# EAGLE design Slave (EAGLE 9.1.3)
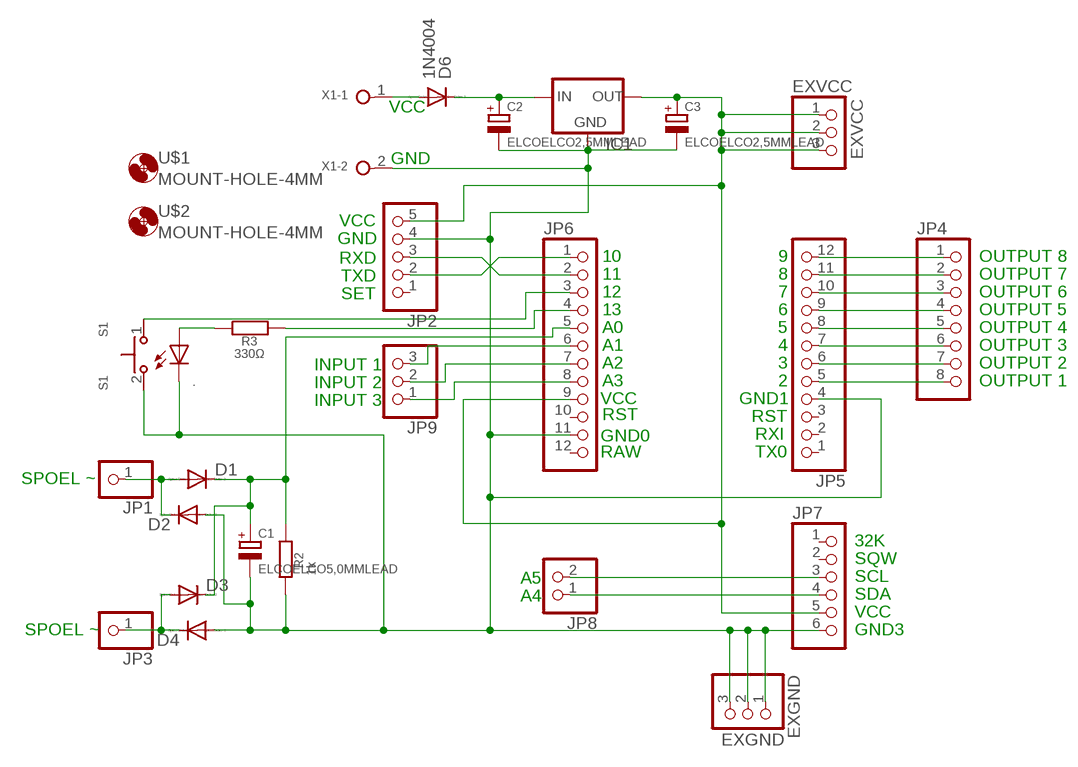
[diagram p0: schematic, sheet 1]

## Parts
.  LED  LED-SMD1206  [CHIPLED_1206]
C1  ELCOELCO5,0MMLEAD  [ELCO5,0MMLEAD]
C2  ELCOELCO2,5MMLEAD  [ELCO-2.5MMLEAD]
C3  ELCOELCO2,5MMLEAD  [ELCO-2.5MMLEAD]
D1  1N4004  [DO41-10]
D2  1N4004  [DO41-10]
D3  1N4004  [DO41-10]
D4  1N4004  [DO41-10]
D6  1N4004  [DO41-10]
EXGND  PINHD-1X3  [1X03]
EXVCC  PINHD-1X3  [1X03]
IC1  78XXS  [78XXS]
JP1  PINHD-1X1  [1X01]
JP2  PINHD-1X5  [1X05]
JP3  PINHD-1X1  [1X01]
JP4  PINHD-1X8  [1X08]
JP5  PINHD-1X12  [1X12]
JP6  PINHD-1X12  [1X12]
JP7  PINHD-1X6  [1X06]
JP8  PINHD-1X2  [1X02]
JP9  PINHD-1X3  [1X03]
R2  1k  RESISTOR-SMD-1206  [R1206W]
R3  330Ω  RESISTOR-SMD-1206  [R1206W]
S1  MICROSWITCH-B3U-1000P  [MICROSWITCH-B3U-1000P]
U$1  MOUNT-HOLE-4MM  [4,0]
U$2  MOUNT-HOLE-4MM  [4,0]
X1  TERMINAL-5MM-2POLE  [W237-132]

## Nets
GND [VCC]: ..C C1.- C2.- C3.- D2.A D4.A EXGND.1 EXGND.2 EXGND.3 IC1.GND JP2.4 JP5.4 JP6.11 JP7.6 R2.1 S1.2 X1.2
N$1: JP7.4 JP8.1
N$2: JP7.3 JP8.2
N$3: JP4.1 JP5.12
N$4: JP4.2 JP5.11
N$5: JP4.3 JP5.10
N$6: JP4.4 JP5.9
N$7: JP4.5 JP5.8
N$8: JP4.6 JP5.7
N$9: JP4.7 JP5.6
N$10: JP4.8 JP5.5
N$12: D1.A D2.C JP1.1
N$13: C1.+ D1.C D3.C JP6.5 R2.2
N$14: JP6.8 JP9.1
N$15: D3.A D4.C JP3.1
N$16: JP6.7 JP9.2
N$17: JP6.6 JP9.3
N$19: JP2.2 JP6.1
N$20: JP6.4 R3.2
N$21: JP2.3 JP6.2
N$22: ..A R3.1
N$23: JP6.3 S1.1
VCC0 [VCC]: D6.A X1.1
VCC1 [VCC]: C2.+ D6.C IC1.IN
VCC2 [VCC]: C3.+ EXVCC.1 EXVCC.2 EXVCC.3 IC1.OUT JP2.5 JP6.9 JP7.5
Unconnected: JP2.1 JP5.1 JP5.2 JP5.3 JP6.10 JP6.12 JP7.1 JP7.2

## Notes on the sheet
- VCC
- GND
- VCC
- GND
- RXD | 10 | 9 | OUTPUT 8
- TXD | 11 | 8 | OUTPUT 7
- SET | 12 | 7 | OUTPUT 6
- 13 | 6 | OUTPUT 5
- A0 | 5 | OUTPUT 4
- A1 | 4 | OUTPUT 3
- INPUT 1 | A2 | 3 | OUTPUT 2
- INPUT 2 | A3 | 2 | OUTPUT 1
- INPUT 3 | VCC | GND1
- RST | RST
- GND0 | RXI
- RAW | TX0
- SPOEL ~
- 32K
- SQW
- A5 | SCL
- A4 | SDA
- VCC
- SPOEL ~ | GND3

## Library data of the parts
. = test:LED-SMD: LED SMD 1206
C1-C3 = ESP8266-12F controller PCB:ELCO: electrolytic capacitor 2.5mm or 3.5mm lead or SMD
D1-D4 D6 = diode:1N4004: DIODE general purpose rectifier, 1 A
EXGND EXVCC JP9 = pinhead:PINHD-1X3: PIN HEADER
IC1 = ESP8266-12F controller PCB:78XXS: VOLTAGE REGULATOR
JP1 JP3 = pinhead:PINHD-1X1: PIN HEADER
JP2 = pinhead:PINHD-1X5: PIN HEADER
JP4 = pinhead:PINHD-1X8: PIN HEADER
JP5 JP6 = pinhead:PINHD-1X12: PIN HEADER
JP7 = pinhead:PINHD-1X6: PIN HEADER
JP8 = pinhead:PINHD-1X2: PIN HEADER
R2 R3 = ESP8266-12F controller PCB:RESISTOR-SMD-1206: Resistor 1206 SMD
S1 = ESP8266-12F controller PCB:MICROSWITCH-B3U-1000P: microswitch
U$1 U$2 = ESP8266-12F controller PCB:MOUNT-HOLE-4MM
X1 = ESP8266-12F controller PCB:TERMINAL-5MM-2POLE: WAGO SCREW CLAMP; OC_FARNELL: unknown; OC_NEWARK: unknown

## Net classes
1 VCC: width 1.016 mm

## Board
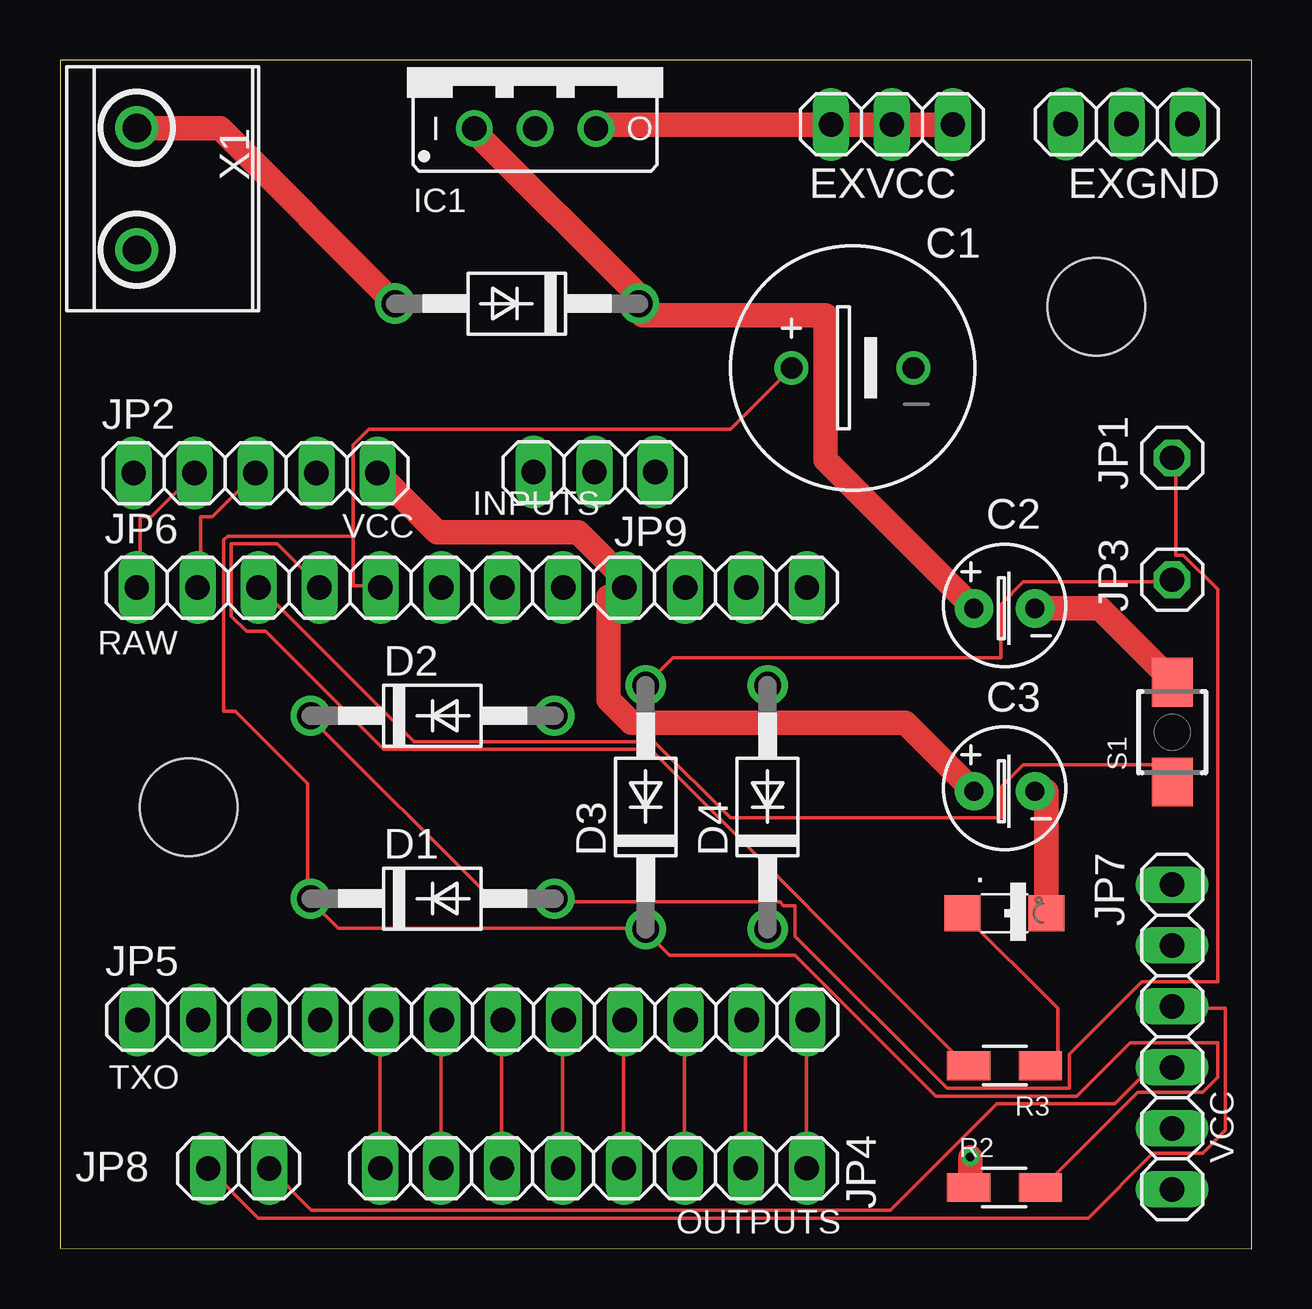
[diagram p1: board, top side]
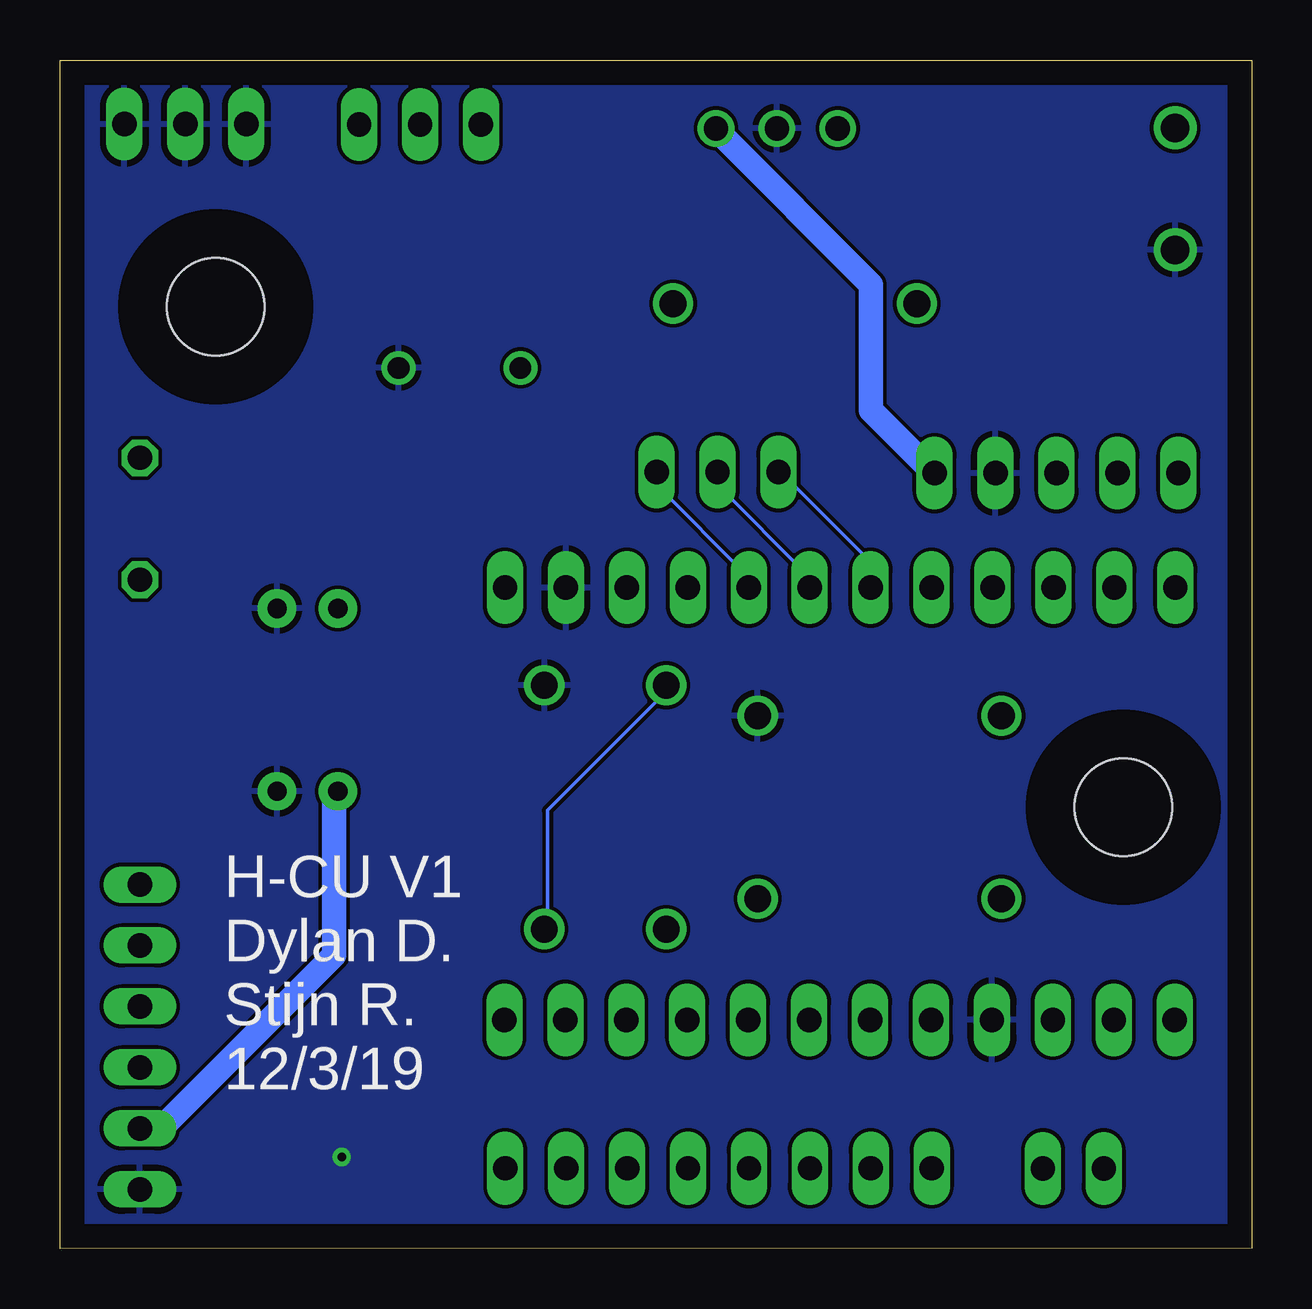
[diagram p2: board, bottom side, seen from below]

Size 49.69 x 49.54 mm. Coordinates in mm from the lower left corner, seen from the top.
Outline: 0,0.02 49.69,0 49.69,49.52 0,49.54 0,0.02
Copper layers (1*16): Top 0.035mm / dielectric 1.5mm / Bottom 0.035mm
Design rules "default": minimum track width 6mil, minimum drill 0.35mm, track to track 6mil, track to pad 6mil, pad to pad 6mil, via to via 6mil, smd to smd 6mil, copper to edge 40mil, drill to drill 6mil, minimum pad ring 10mil, minimum via ring 8mil, stop-mask expansion 4mil, vias tented up to drill 0mil, thermal gap 10mil

### Footprints (pad centres in the part's own frame; a part is rotated, then mirrored left to right if it is on the bottom)
CHIPLED_1206 = smd 1.5 x 1.5: A 0,-1.75; C 0,1.75
ELCO5,0MMLEAD = drill 0.9: + -2.54,0; - 2.54,0
ELCO-2.5MMLEAD = drill 0.8 pad 1.6: + -1.27,0; - 1.27,0
DO41-10 = drill 1.118: A 5.08,0; C -5.08,0
1X03 = drill 1.016 long: 1 -2.54,0; 2 0,0; 3 2.54,0
78XXS = drill 1.016: GND 0,-2.54; IN -2.54,-2.54; OUT 2.54,-2.54
1X01 = drill 1.016 octagon: 1 0,0
1X05 = drill 1.016 long: 1 -5.08,0; 2 -2.54,0; 3 0,0; 4 2.54,0; 5 5.08,0
1X08 = drill 1.016 long: 1 -8.89,0; 2 -6.35,0; 3 -3.81,0; 4 -1.27,0; 5 1.27,0; 6 3.81,0; 7 6.35,0; 8 8.89,0
1X12 = drill 1.016 long: 1 -13.97,0; 2 -11.43,0; 3 -8.89,0; 4 -6.35,0; 5 -3.81,0; 6 -1.27,0; 7 1.27,0; 8 3.81,0; 9 6.35,0; 10 8.89,0; 11 11.43,0; 12 13.97,0
1X06 = drill 1.016 long: 1 -6.35,0; 2 -3.81,0; 3 -1.27,0; 4 1.27,0; 5 3.81,0; 6 6.35,0
1X02 = drill 1.016 long: 1 -1.27,0; 2 1.27,0
R1206W = smd 1.8 x 1.2: 1 -1.499,0; 2 1.499,0
MICROSWITCH-B3U-1000P = smd 2.032 x 1.7: 1 -2.081,0; 2 2.081,0
4,0 = hole 4.064: 0,0
W237-132 = drill 1.194: 1 -2.54,-0.635; 2 2.54,-0.635

### Placement (x,y rotation side)
.  39.37,13.99 270 top
C1  33.03,36.71 0 top
C2  39.37,26.69 0 top
C3  39.37,19.07 0 top
D1  15.53,14.6 0 top
D2  15.53,22.22 0 top
D3  24.42,18.41 90 top
D4  29.5,18.41 90 top
D6  19.05,39.39 180 top
EXGND  44.46,46.87 180 top
EXVCC  34.68,46.86 0 top
IC1  19.8,49.23 0 top
JP1  46.36,32.96 90 top
JP2  8.15,32.33 0 top
JP3  46.36,27.88 90 top
JP4  22.24,3.36 180 top
JP5  17.19,9.54 0 top
JP6  17.17,27.55 0 top
JP7  46.36,8.83 270 top
JP8  7.45,3.36 180 top
JP9  22.28,32.37 180 top
R2  39.37,2.56 0 top
R3  39.37,7.64 180 top
S1  46.36,21.53 90 top
U$1  5.37,18.41 0 top
U$2  43.19,39.25 0 top
X1  3.84,44.17 270 top

### Tracks (layer width: path | path; a pad name or v marks a point on that pad's centre or on a via)
GND  (via drill 0.35)
  Top 1.016: C3.- 41.12,19.07 ..C | v37.94,3.83 37.94,2.56 R2.1 | C2.- 43.34,26.69 46.35,23.67 S1.2
  pour Bottom: 0,0.02 0,49.52 49.53,49.52 49.53,0.02
N$1
  Top 0.152: JP8.1 10.48,1.61 34.61,1.61 39.05,6.05 43.97,6.05 45.4,7.48 46.35,7.48 JP7.4
N$2
  Top 0.152: JP8.2 8.26,1.29 42.86,1.29 45.56,3.99 47.62,3.99 48.58,4.94 48.58,10.02 46.51,10.02 JP7.3
N$3
  Top 0.152: JP4.1 31.11,3.51 31.11,9.39 JP5.12
N$4
  Top 0.152: JP4.2 28.57,3.51 28.57,9.39 JP5.11
N$5
  Top 0.152: JP4.3 26.04,3.51 26.04,9.39 JP5.10
N$6
  Top 0.152: JP4.4 23.5,3.51 23.5,9.39 JP5.9
N$7
  Top 0.152: JP4.5 20.95,3.51 20.95,9.39 JP5.8
N$8
  Top 0.152: JP4.6 18.41,3.51 18.41,9.39 JP5.7
N$9
  Top 0.152: JP4.7 15.88,3.51 15.88,9.39 JP5.6
N$10
  Top 0.152: JP4.8 13.34,3.51 13.34,9.39 JP5.5
N$12
  Top 0.152: JP1.1 46.51,32.88 46.51,28.91 46.83,28.91 48.26,27.48 48.26,11.13 45.09,11.13 42.07,8.12 42.07,6.69 36.99,6.69 30.64,13.04 30.64,14.31 30.16,14.31 30,14.47 20.64,14.47 D1.A 20.48,14.62 17.94,14.62 10.48,22.09 D2.C
N$13
  Top 0.152: 12.22,29.71 12.22,27.64 13.34,27.64 JP6.5 | 12.22,29.71 12.22,33.52 12.86,34.15 27.94,34.15 30.48,36.69 C1.+ | R2.2 40.96,2.56 44.93,6.53 47.62,6.53 48.26,7.16 48.26,8.59 44.61,8.59 42.39,6.37 36.51,6.37 30.64,12.24 25.4,12.24 24.45,13.2 D3.C 24.29,13.35 11.59,13.35 10.48,14.47 D1.C 10.32,14.62 10.32,19.39 7.3,22.4 6.83,22.4 6.83,29.55 6.99,29.71 12.22,29.71
N$14
  Bottom 0.152: JP6.8 21.11,27.64 21.11,28.12 24.77,31.77 24.77,32.25 JP9.1
N$15
  Top 0.152: JP3.1 46.35,27.8 40.16,27.8 39.21,26.85 39.21,24.63 25.56,24.63 24.45,23.51 D3.A
  Bottom 0.152: D4.C 29.37,13.35 29.37,18.28 24.29,23.36 D3.A
N$16
  Bottom 0.152: JP6.7 18.57,27.64 18.57,28.12 22.23,31.77 22.23,32.25 JP9.2
N$17
  Bottom 0.152: JP6.6 16.03,27.64 16.03,28.75 19.68,32.4 JP9.3
N$19
  Top 0.152: JP6.1 3.33,27.64 3.33,30.5 3.81,30.5 5.56,32.25 JP2.2
N$20
  Top 0.152: R3.2 37.78,7.64 24.61,20.82 13.49,20.82 8.57,25.74 7.78,25.74 7.14,26.37 7.14,29.39 9.05,29.39 10.79,27.64 JP6.4
N$21
  Top 0.152: JP6.2 5.87,27.64 5.87,30.5 6.35,30.5 8.1,32.25 JP2.3
N$22
  Top 0.152: ..A 41.59,10.02 41.59,7.64 40.96,7.64 R3.1
N$23
  Top 0.152: S1.1 46.35,19.55 45.72,20.18 40.16,20.18 39.21,19.23 39.21,17.96 27.94,17.96 24.77,21.13 14.76,21.13 8.41,27.48 JP6.3
VCC0
  Top 1.016: D6.A 6.67,46.69 3.33,46.69 X1.1
VCC1
  Top 1.016: IC1.IN 17.3,46.53 24.13,39.71 D6.C 24.29,38.91 31.91,38.91 31.91,32.88 C2.+
VCC2
  Top 1.016: IC1.OUT 22.38,46.69 22.54,46.85 32.07,46.85 EXVCC.1 32.54,46.85 34.61,46.85 EXVCC.2 35.08,46.85 37.15,46.85 EXVCC.3 | JP2.5 13.34,32.25 15.72,29.86 21.59,29.86 23.5,27.96 23.5,27.64 JP6.9 23.18,27.17 22.86,27.17 22.86,22.88 23.81,21.93 35.24,21.93 C3.+
  Bottom 1.016: C3.+ 38.26,18.91 38.26,12.24 45.4,5.1 46.35,5.1 JP7.5 | IC1.OUT 22.23,46.53 15.88,40.18 15.88,34.94 13.34,32.4 JP2.5

### Text on the board
bPlace: H-CU V1 / Dylan D. / Stijn R. / 12/3/19
tNames: INPUTS | VCC | RAW | TXO | VCC | OUTPUTS